# EAGLE schematic ledblinker (EAGLE 6.4)
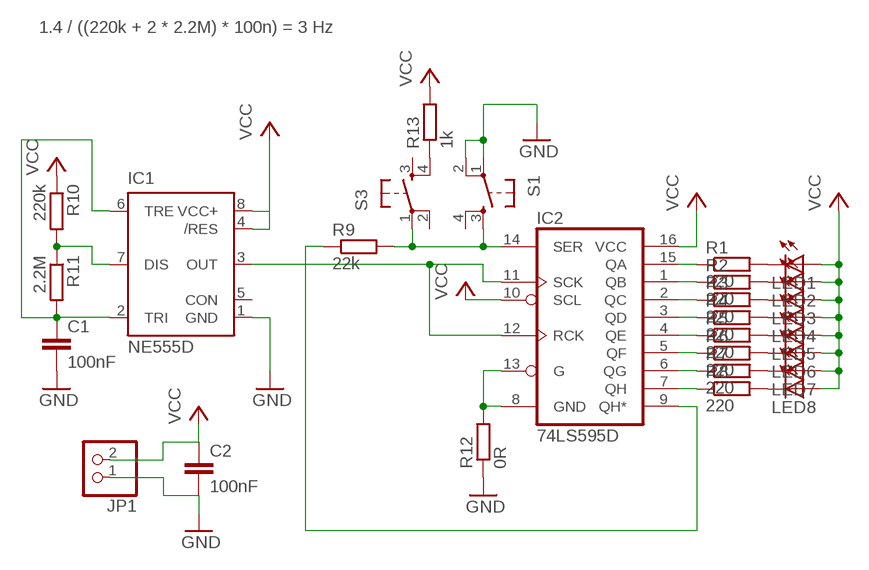
[diagram p0: schematic, sheet 1]

## Parts
C1  100nF  C-EUC1206  [C1206]
C2  100nF  C-EUC1206  [C1206]
IC1  NE555D  [SO08]
IC2  74LS595D  [SO16]
JP1  PINHD-1X2/90  [1X02/90]
LED1  LEDCHIPLED_1206  [CHIPLED_1206]
LED2  LEDCHIPLED_1206  [CHIPLED_1206]
LED3  LEDCHIPLED_1206  [CHIPLED_1206]
LED4  LEDCHIPLED_1206  [CHIPLED_1206]
LED5  LEDCHIPLED_1206  [CHIPLED_1206]
LED6  LEDCHIPLED_1206  [CHIPLED_1206]
LED7  LEDCHIPLED_1206  [CHIPLED_1206]
LED8  LEDCHIPLED_1206  [CHIPLED_1206]
R1  220  R-EU_M1206  [M1206]
R2  220  R-EU_M1206  [M1206]
R3  220  R-EU_M1206  [M1206]
R4  220  R-EU_M1206  [M1206]
R5  220  R-EU_M1206  [M1206]
R6  220  R-EU_M1206  [M1206]
R7  220  R-EU_M1206  [M1206]
R8  220  R-EU_M1206  [M1206]
R9  22k  R-EU_M1206  [M1206]
R10  220k  R-EU_M1206  [M1206]
R11  2.2M  R-EU_M1206  [M1206]
R12  0R  R-EU_R1206  [R1206]
R13  1k  R-EU_M1206  [M1206]
S1  TAC_SWITCHSMD2  [TACTILE_SWITCH_TALL]
S3  TAC_SWITCHSMD2  [TACTILE_SWITCH_TALL]

## Nets
GND: C1.2 C2.2 IC1.1(GND) JP1.1 R12.1 S1.1 S1.2
N$1: IC2.15(QA) R1.1
N$2: IC2.1(QB) R2.1
N$3: IC2.2(QC) R3.1
N$4: IC2.3(QD) R4.1
N$5: IC2.4(QE) R5.1
N$6: IC2.5(QF) R6.1
N$7: IC2.6(QG) R7.1
N$8: IC2.7(QH) R8.1
N$9: IC2.9(QH*) R9.1
N$10: IC2.14(SER) R9.2 S1.3 S3.1
N$11: C1.1 IC1.2(TRI) IC1.6(TRE) R11.2
N$12: IC1.3(OUT) IC2.11(SCK) IC2.12(RCK)
N$13: IC1.7(DIS) R10.2 R11.1
N$14: LED1.C R1.2
N$15: LED2.C R2.2
N$16: LED3.C R3.2
N$17: LED4.C R4.2
N$18: LED5.C R5.2
N$19: LED6.C R6.2
N$20: LED7.C R7.2
N$21: LED8.C R8.2
N$22: IC2.8(GND) IC2.13(G) R12.2
N$23: R13.1 S3.4
VCC: C2.1 IC1.4(/RES) IC1.8(VCC+) IC2.10(SCL) IC2.16(VCC) JP1.2 LED1.A LED2.A LED3.A LED4.A LED5.A LED6.A LED7.A LED8.A R10.1 R13.2
Unconnected: IC1.5(CON) S1.4 S3.2 S3.3

## Notes on the sheet
- 1.4 / ((220k + 2 * 2.2M) * 100n) = 3 Hz

## Library data of the parts
C1 C2 = rcl:C-EU: CAPACITOR, European symbol
IC1 = SparkFun:NE555: General purpose bipolar Timer
IC2 = SparkFun:74*595: 8-bit SHIFT REGISTER, output latch
JP1 = pinhead:PINHD-1X2: PIN HEADER
LED1-LED8 = led:LED: LED OSRAM: - CHIPLED LG R971, LG N971, LY N971, LG Q971, LY Q971, LO R971, LY R971 LH N974, LH R974 LS Q976, LO Q976, LY Q976 LO Q996 - Hyper CHIPLED LW Q18S LB Q993, LB Q99A, LB R99A - SideLED LS A670, LO A670, LY A670, LG A670, LP A670 LB A673, LV A673, LT A673, LW A673 LH A674 LY A675 LS A676, LA A676, LO A676, LY A676, LW A676 LS A679, LY A679, LG A679 - Hyper Micro SIDELED® LS Y876, LA Y876, LO Y876, LY Y876 LT Y87S - SmartLED LW L88C, LW L88S LB L89C, LB L89S, LG L890 LS L89K, LO L89K, LY L89K LS L896, LA L896, LO L896, LY L896 - TOPLED LS T670, LO T670, LY T670, LG T670, LP T670 LSG T670, LSP T670, LSY T670, LOP T670, LYG T670 LG T671, LOG T671, LSG T671 LB T673, LV T673, LT T673, LW T673 LH T674 LS T676, LA T676, LO T676, LY T676, LB T676, LH T676, LSB T676, LW T676 LB T67C, LV T67C, LT T67C, LS T67K, LO T67K, LY T67K, LW E67C LS E67B, LA E67B, LO E67B, LY E67B, LB E67C, LV E67C, LT E67C LW T67C LS T679, LY T679, LG T679 LS T770, LO T770, LY T770, LG T770, LP T770 LB T773, LV T773, LT T773, LW T773 LH T774 LS E675, LA E675, LY E675, LS T675 LS T776, LA T776, LO T776, LY T776, LB T776 LHGB T686 LT T68C, LB T68C - Hyper Mini TOPLED® LB M676 - Mini TOPLED Santana® LG M470 LS M47K, LO M47K, LY M47K Source: http://www.osram.convergy.de LUXEON: - LUMILED® LXK2-PW12-R00, LXK2-PW12-S00, LXK2-PW14-U00, LXK2-PW14-V00 LXK2-PM12-R00, LXK2-PM12-S00, LXK2-PM14-U00 LXK2-PE12-Q00, LXK2-PE12-R00, LXK2-PE12-S00, LXK2-PE14-T00, LXK2-PE14-U00 LXK2-PB12-K00, LXK2-PB12-L00, LXK2-PB12-M00, LXK2-PB14-N00, LXK2-PB14-P00, LXK2-PB14-Q00 LXK2-PR12-L00, LXK2-PR12-M00, LXK2-PR14-Q00, LXK2-PR14-R00 LXK2-PD12-Q00, LXK2-PD12-R00, LXK2-PD12-S00 LXK2-PH12-R00, LXK2-PH12-S00 LXK2-PL12-P00, LXK2-PL12-Q00, LXK2-PL12-R00 Source: www.luxeon.com KINGBRIGHT: KA-3528ASYC Source: www.kingbright.com
R1-R13 = rcl:R-EU_: RESISTOR, European symbol
S1 S3 = hsa:TAC_SWITCH: Momentary Switch Button commonly used for reset or general input. Spark Fun Electronics SKU : COM-00097